# EAGLE design USBC TEST (EAGLE 8.0.0)
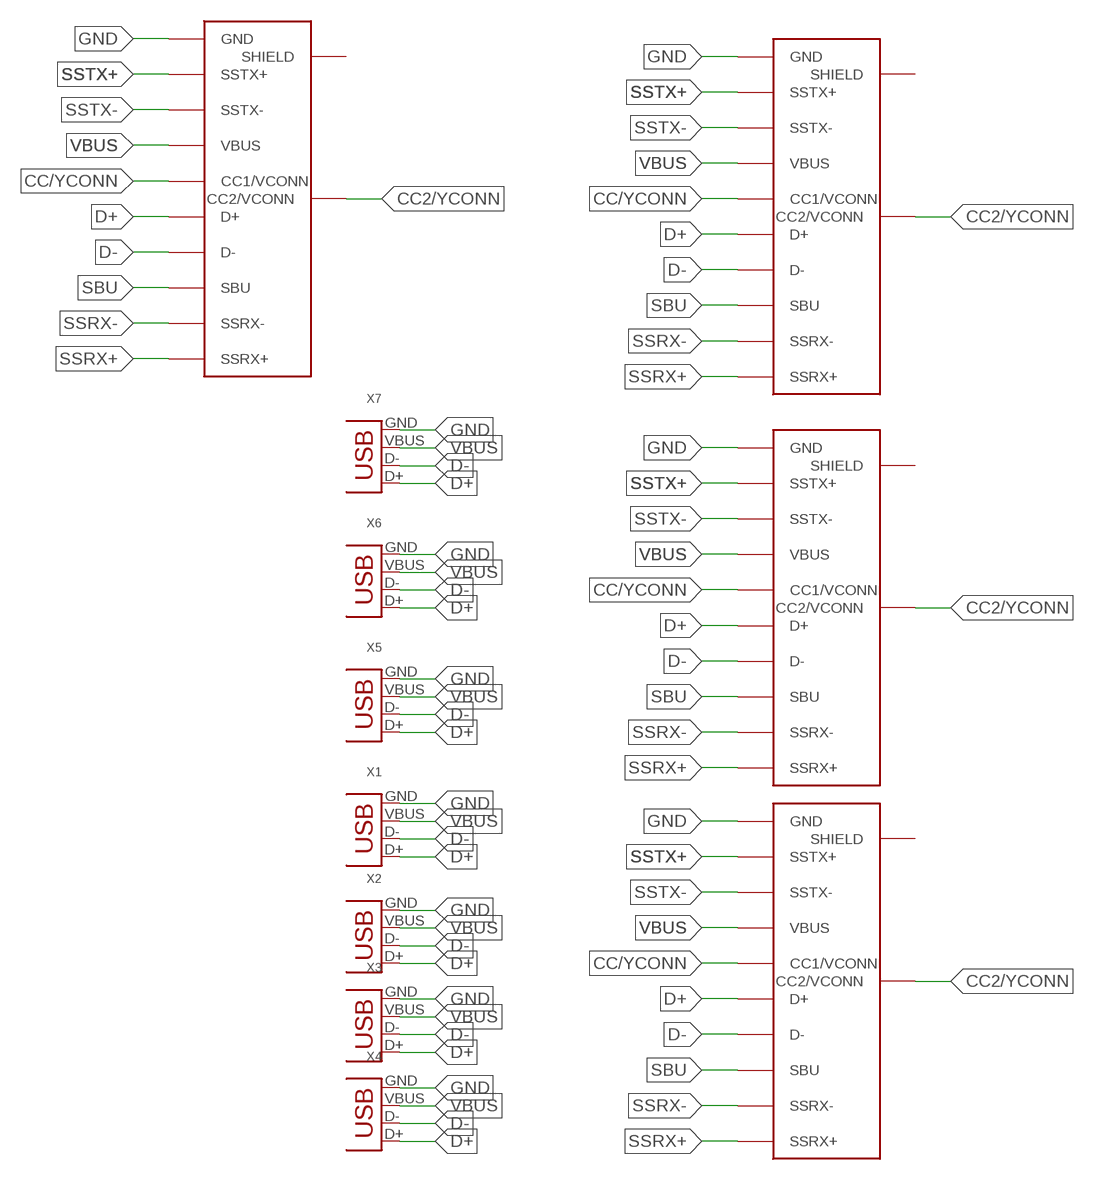
[diagram p0: schematic, sheet 1]

## Parts
U$1  USB-TYPE-C  [USB-TYPE-C-SMT]
U$2  USB-TYPE-C  [USB-TYPE-C-SMT]
U$3  USB-TYPE-C  [USB-TYPE-C-SMT]
U$4  USB-TYPE-C  [USB-TYPE-C-SMT]
X1  USB-A-H  [USB-A-H]
X2  USB-A-H  [USB-A-H]
X3  USB-A-H  [USB-A-H]
X4  USB-A-H  [USB-A-H]
X5  USB-A-H  [USB-A-H]
X6  USB-A-H  [USB-A-H]
X7  USB-A-H  [USB-A-H]

## Nets
CC2/YCONN: U$1.B5(CC2/VCONN) U$2.B5(CC2/VCONN) U$3.B5(CC2/VCONN) U$4.B5(CC2/VCONN)
CC/YCONN: U$1.5(CC1/VCONN) U$2.5(CC1/VCONN) U$3.5(CC1/VCONN) U$4.5(CC1/VCONN)
D+: U$1.6(D+) U$1.B6(D+) U$2.6(D+) U$2.B6(D+) U$3.6(D+) U$3.B6(D+) U$4.6(D+) U$4.B6(D+) X1.D+ X2.D+ X3.D+ X4.D+ X5.D+ X6.D+ X7.D+
D-: U$1.7(D-) U$1.B7(D-) U$2.7(D-) U$2.B7(D-) U$3.7(D-) U$3.B7(D-) U$4.7(D-) U$4.B7(D-) X1.D- X2.D- X3.D- X4.D- X5.D- X6.D- X7.D-
GND: U$1.1(GND) U$1.12(GND) U$1.B1(GND) U$1.B12(GND) U$2.1(GND) U$2.12(GND) U$2.B1(GND) U$2.B12(GND) U$3.1(GND) U$3.12(GND) U$3.B1(GND) U$3.B12(GND) U$4.1(GND) U$4.12(GND) U$4.B1(GND) U$4.B12(GND) X1.GND X2.GND X3.GND X4.GND X5.GND X6.GND X7.GND
SBU: U$1.8(SBU) U$1.B8(SBU) U$2.8(SBU) U$2.B8(SBU) U$3.8(SBU) U$3.B8(SBU) U$4.8(SBU) U$4.B8(SBU)
SSRX+: U$1.11(SSRX+) U$1.B11(SSRX+) U$2.11(SSRX+) U$2.B11(SSRX+) U$3.11(SSRX+) U$3.B11(SSRX+) U$4.11(SSRX+) U$4.B11(SSRX+)
SSRX-: U$1.10(SSRX-) U$1.B10(SSRX-) U$2.10(SSRX-) U$2.B10(SSRX-) U$3.10(SSRX-) U$3.B10(SSRX-) U$4.10(SSRX-) U$4.B10(SSRX-)
SSTX+: U$1.2(SSTX+) U$1.B2(SSTX+) U$2.2(SSTX+) U$2.B2(SSTX+) U$3.2(SSTX+) U$3.B2(SSTX+) U$4.2(SSTX+) U$4.B2(SSTX+)
SSTX-: U$1.3(SSTX-) U$1.B3(SSTX-) U$2.3(SSTX-) U$2.B3(SSTX-) U$3.3(SSTX-) U$3.B3(SSTX-) U$4.3(SSTX-) U$4.B3(SSTX-)
VBUS: U$1.4(VBUS) U$1.9(VBUS) U$1.B4(VBUS) U$1.B9(VBUS) U$2.4(VBUS) U$2.9(VBUS) U$2.B4(VBUS) U$2.B9(VBUS) U$3.4(VBUS) U$3.9(VBUS) U$3.B4(VBUS) U$3.B9(VBUS) U$4.4(VBUS) U$4.9(VBUS) U$4.B4(VBUS) U$4.B9(VBUS) X1.VBUS X2.VBUS X3.VBUS X4.VBUS X5.VBUS X6.VBUS X7.VBUS
Unconnected: U$1.P$1(SHIELD) U$1.P$2(SHIELD) U$1.P$3(SHIELD) U$1.P$4(SHIELD) U$1.P$5(SHIELD) U$1.P$6(SHIELD) U$1.P$7(SHIELD) U$1.P$8(SHIELD) U$1.P$9(SHIELD) U$1.P$10(SHIELD) U$1.P$11(SHIELD) U$1.P$12(SHIELD) U$1.P$13(SHIELD) U$1.P$14(SHIELD) U$1.P$15(SHIELD) U$1.P$16(SHIELD) U$1.P$17(SHIELD) U$1.P$18(SHIELD) U$1.P$19(SHIELD) U$1.P$20(SHIELD) U$1.P$21(SHIELD) U$1.P$22(SHIELD) U$1.P$23(SHIELD) U$1.P$24(SHIELD) U$1.P$25(SHIELD) U$1.P$26(SHIELD) U$1.P$27(SHIELD) U$1.P$28(SHIELD) U$2.P$1(SHIELD) U$2.P$2(SHIELD) U$2.P$3(SHIELD) U$2.P$4(SHIELD) U$2.P$5(SHIELD) U$2.P$6(SHIELD) U$2.P$7(SHIELD) U$2.P$8(SHIELD) U$2.P$9(SHIELD) U$2.P$10(SHIELD) U$2.P$11(SHIELD) U$2.P$12(SHIELD) U$2.P$13(SHIELD) U$2.P$14(SHIELD) U$2.P$15(SHIELD) U$2.P$16(SHIELD) U$2.P$17(SHIELD) U$2.P$18(SHIELD) U$2.P$19(SHIELD) U$2.P$20(SHIELD) U$2.P$21(SHIELD) U$2.P$22(SHIELD) U$2.P$23(SHIELD) U$2.P$24(SHIELD) U$2.P$25(SHIELD) U$2.P$26(SHIELD) U$2.P$27(SHIELD) U$2.P$28(SHIELD) U$3.P$1(SHIELD) U$3.P$2(SHIELD) U$3.P$3(SHIELD) U$3.P$4(SHIELD) U$3.P$5(SHIELD) U$3.P$6(SHIELD) U$3.P$7(SHIELD) U$3.P$8(SHIELD) U$3.P$9(SHIELD) U$3.P$10(SHIELD) U$3.P$11(SHIELD) U$3.P$12(SHIELD) U$3.P$13(SHIELD) U$3.P$14(SHIELD) U$3.P$15(SHIELD) U$3.P$16(SHIELD) U$3.P$17(SHIELD) U$3.P$18(SHIELD) U$3.P$19(SHIELD) U$3.P$20(SHIELD) U$3.P$21(SHIELD) U$3.P$22(SHIELD) U$3.P$23(SHIELD) U$3.P$24(SHIELD) U$3.P$25(SHIELD) U$3.P$26(SHIELD) U$3.P$27(SHIELD) U$3.P$28(SHIELD) U$4.P$1(SHIELD) U$4.P$2(SHIELD) U$4.P$3(SHIELD) U$4.P$4(SHIELD) U$4.P$5(SHIELD) U$4.P$6(SHIELD) U$4.P$7(SHIELD) U$4.P$8(SHIELD) U$4.P$9(SHIELD) U$4.P$10(SHIELD) U$4.P$11(SHIELD) U$4.P$12(SHIELD) U$4.P$13(SHIELD) U$4.P$14(SHIELD) U$4.P$15(SHIELD) U$4.P$16(SHIELD) U$4.P$17(SHIELD) U$4.P$18(SHIELD) U$4.P$19(SHIELD) U$4.P$20(SHIELD) U$4.P$21(SHIELD) U$4.P$22(SHIELD) U$4.P$23(SHIELD) U$4.P$24(SHIELD) U$4.P$25(SHIELD) U$4.P$26(SHIELD) U$4.P$27(SHIELD) U$4.P$28(SHIELD)

## Library data of the parts
U$1-U$4 = lio:USB-TYPE-C; MPN: 12401562E4#2A; OC_NEWARK: 52Y0685
X1-X7 = con-usb-3:USB: USB Connectors; MPN: 48394-0003; OC_NEWARK: 29X4572

## Net classes
0 default: width 0.305 mm, drill 0.508 mm, clearance 0.254 mm

## Board
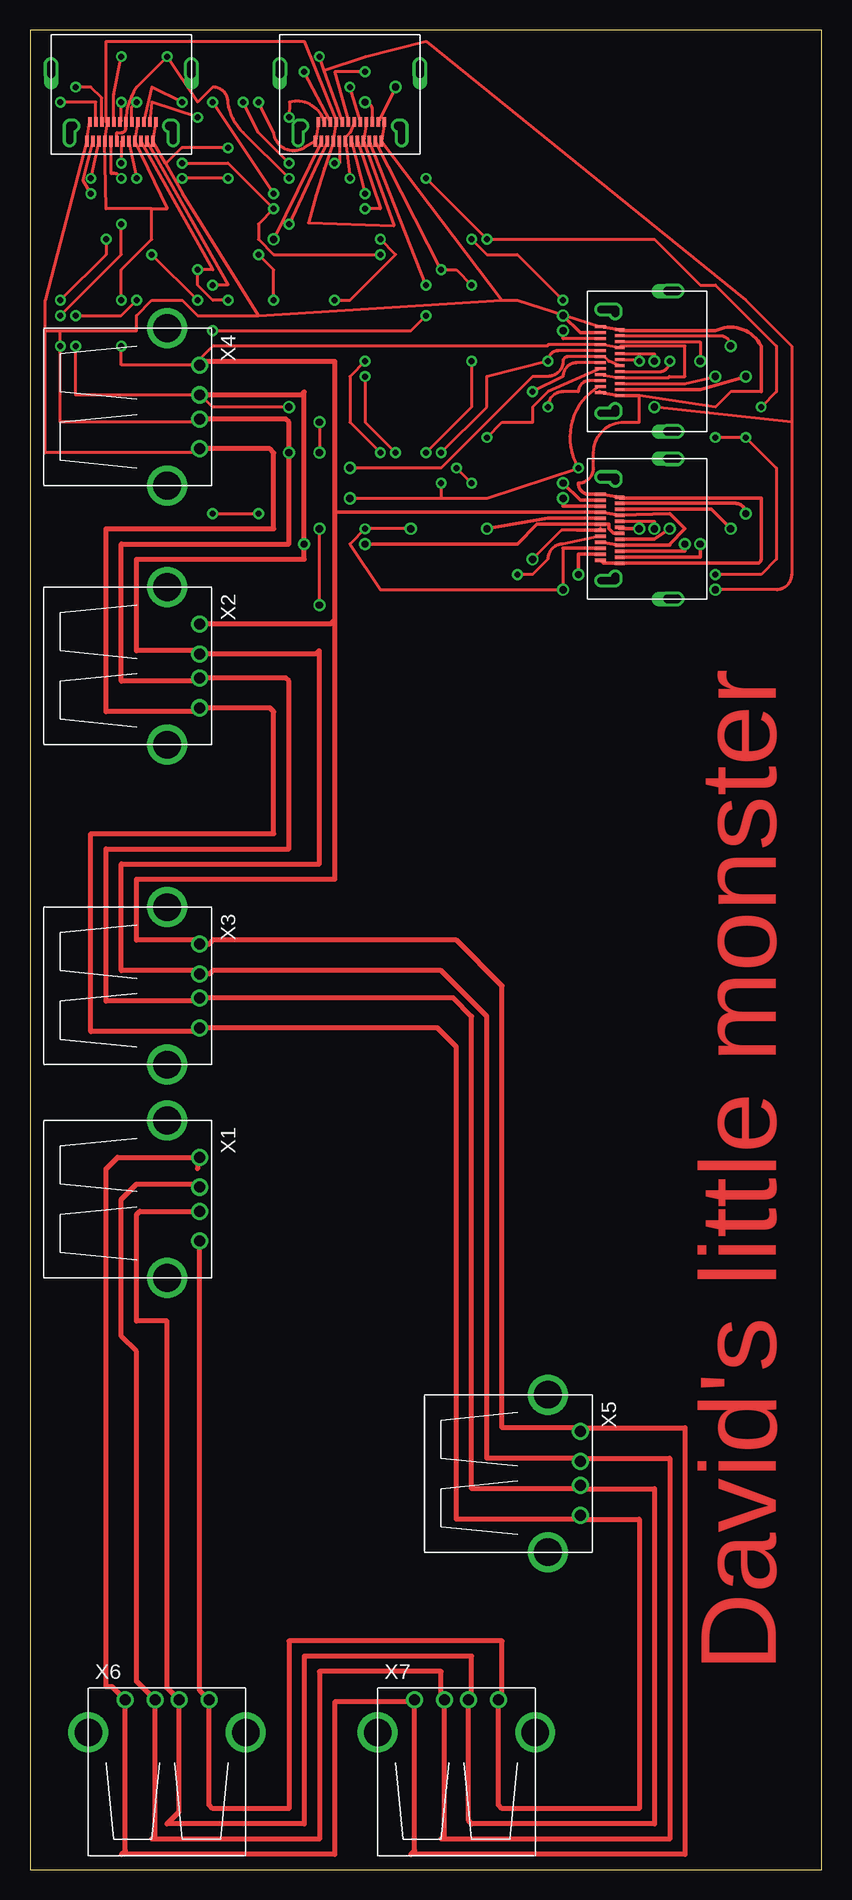
[diagram p1: board, top side]
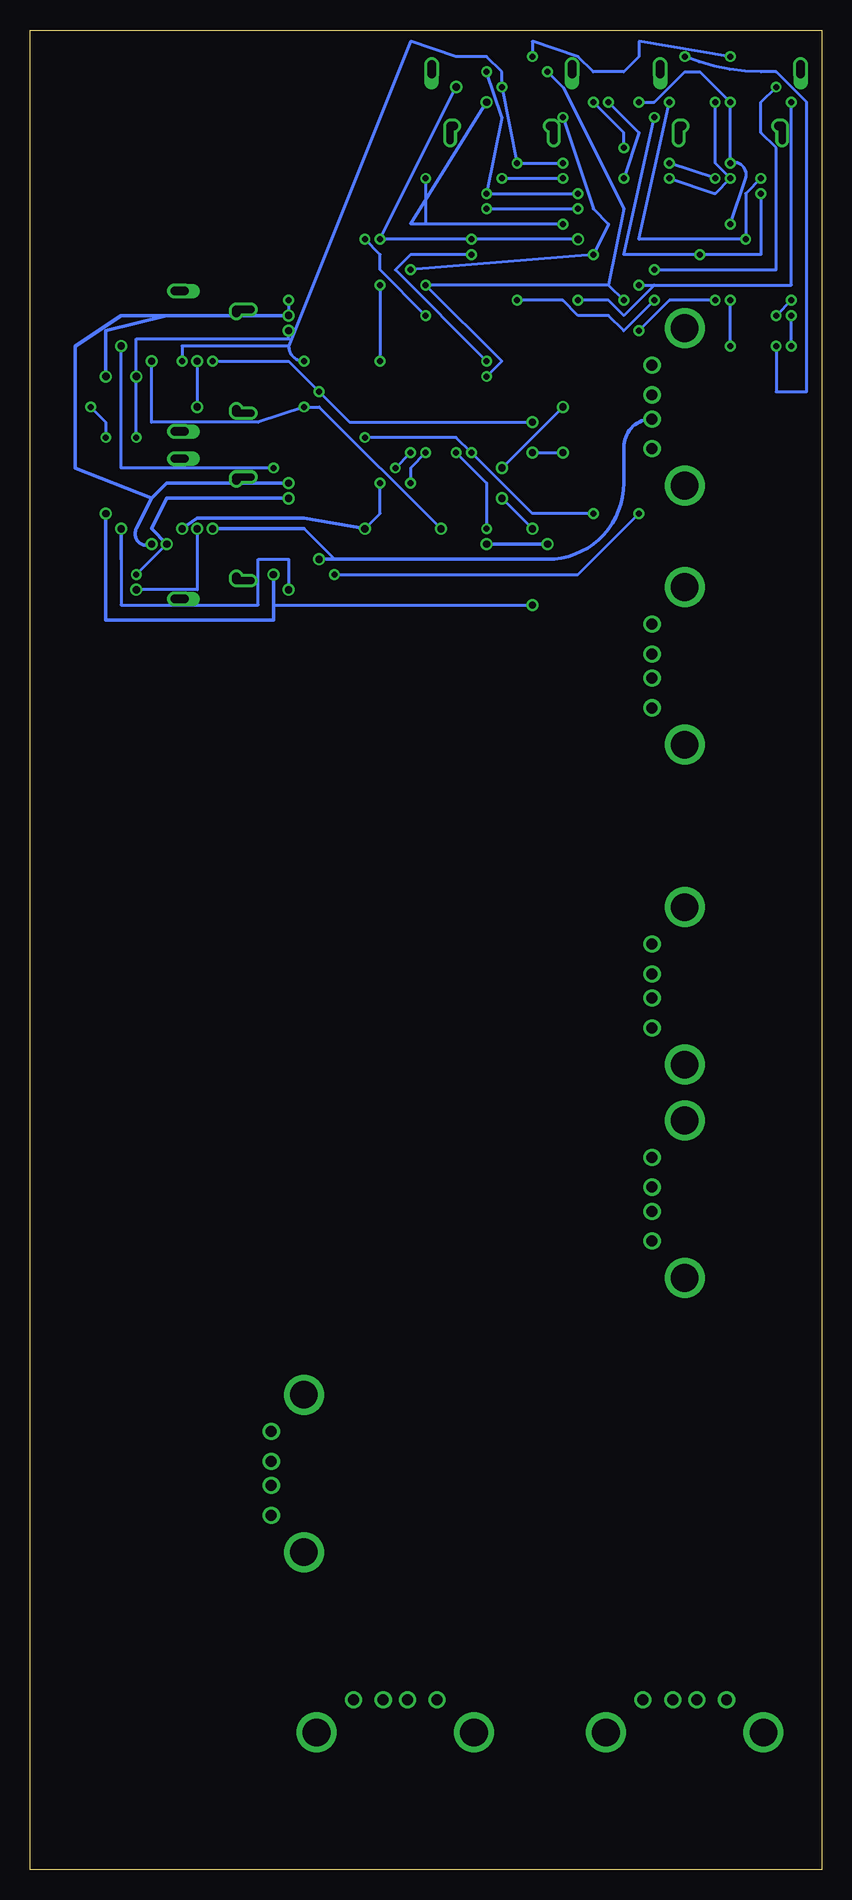
[diagram p2: board, bottom side, seen from below]

Size 66.02 x 153.34 mm. Coordinates in mm from the lower left corner, seen from the top.
Outline: 0,0 66.02,0 66.02,153.34 0,153.34 0,0
Copper layers (1*16): Top 0.035mm / dielectric 1.5mm / Bottom 0.035mm
Design rules "default": minimum track width 10mil, minimum drill 24mil, track to track 8mil, track to pad 8mil, pad to pad 8mil, via to via 8mil, smd to smd 8mil, copper to edge 40mil, drill to drill 8mil, minimum pad ring 10mil, minimum via ring 8mil, stop-mask expansion 4mil, vias tented up to drill 0mil, thermal gap 10mil

### Footprints (pad centres in the part's own frame; a part is rotated, then mirrored left to right if it is on the bottom)
USB-TYPE-C-SMT = smd 0.27 x 0.9: 1 -2.625,0.7; 2 -2.125,0.7; 3 -1.625,0.7; 4 -1.125,0.7; 5 -0.625,0.7; 6 -0.125,0.7; 7 0.375,0.7; 8 0.875,0.7; 9 1.375,0.7; 10 1.875,0.7; 11 2.375,0.7; 12 2.875,0.7 | smd 0.27 x 0.8: B1 2.625,-0.9; B2 2.125,-0.9; B3 1.625,-0.9; B4 1.125,-0.9; B5 0.625,-0.9; B6 0.125,-0.9; B7 -0.375,-0.9; B8 -0.875,-0.9; B9 -1.375,-0.9; B10 -1.875,-0.9; B11 -2.375,-0.9; B12 -2.875,-0.9 | drill 0.6: P$1 -4.32,0.25; P$2 4.32,0.65; P$3 -4.32,0.65; P$4 -4.32,0.45; P$7 -4.32,-0.35; P$8 -4.32,0.05; P$9 -4.32,-0.15; P$10 4.32,0.45; P$11 4.32,0.25; P$12 4.32,0.05; P$13 4.32,-0.15; P$14 4.32,-0.35 | drill 0.7 offset: P$5 5.85,-5.4; P$23 -5.85,-5.4 | drill 0.7: P$6 -5.85,-5.3; P$15 4.27,-0.55; P$16 -4.02,-0.55; P$17 -4.27,-0.55; P$18 4.02,-0.55; P$19 -5.85,-5.7; P$20 -5.85,-5.5; P$21 -5.85,-5.1; P$22 -5.85,-4.9; P$24 5.85,-5.7; P$25 5.85,-5.5; P$26 5.85,-5.3; P$27 5.85,-5.1; P$28 5.85,-4.9
USB-A-H = drill 0.914: D+ 2.718,-1.003; D- 2.718,1.003; GND 2.718,-3.493; VBUS 2.718,3.493 | drill 2.311: P$5 0,-6.566; P$6 0,6.566

### Placement (x,y rotation side)
U$1  48.26,125.73 90 top
U$2  48.26,111.76 90 top
U$3  26.67,144.78 180 top
U$4  7.62,144.78 180 top
X1  11.43,55.88 0 top
X2  11.43,100.33 0 top
X3  11.43,73.66 0 top
X4  11.43,121.92 0 top
X5  43.18,33.02 0 top
X6  11.43,11.43 90 top
X7  35.56,11.43 90 top

### Tracks (layer width: path | path; a pad name or v marks a point on that pad's centre or on a via)
CC2/YCONN  (via drill 0.5, 0.6)
  Top 0.254: U$1.B5 52.07,126.36 v52.07,125.73 | U$2.B5 52.07,112.39 v52.07,111.76 | v57.15,106.68 62.23,106.68 arc90 63.5,107.95 63.5,120.65 | 63.5,120.65 v52.07,121.92 | 24.53,150 U$3.B5 25.46,147.34 | 24.53,150 v24.13,151.13 | U$4.B5 7,147.97 v7.62,151.13 | 24.53,150 27.94,151.13 33.02,152.4 59.69,130.81 63.5,127 63.5,120.65
  Bottom 0.254: v52.07,111.76 52.07,106.68 v57.15,106.68 | v52.07,125.73 v52.07,121.92 | v7.62,151.13 15.24,152.4 15.24,151.13 16.51,149.86 19.05,149.86 20.32,151.13 24.13,152.4 v24.13,151.13
CC/YCONN  (via drill 0.5)
  Top 0.254: U$4.5 v8.89,140.97 | U$3.5 29.21,138.43 v27.94,138.43 | v12.7,142.24 16.51,142.24 v20.32,138.43 19.05,137.16 19.05,135.89 20.32,134.62 v29.21,134.62 | U$1.5 43.18,123.19 41.91,121.92 41.91,120.65 39.37,120.65 v38.1,119.38 | U$2.5 44.45,110.49 arc90 43.18,109.22 41.91,107.95 v40.64,107.95 | v15.24,113.03 v19.05,113.03 | v29.21,118.11 26.67,120.65 26.67,124.46 v27.94,125.73
  Bottom 0.254: v8.89,140.97 v12.7,142.24 | v27.94,138.43 v20.32,138.43 | v38.1,119.38 30.48,119.38 v29.21,118.11 24.13,113.03 v19.05,113.03 | v15.24,113.03 20.32,107.95 v40.64,107.95 | v27.94,125.73 35.56,133.35 34.29,134.62 v29.21,134.62
D+  (via drill 0.5, 0.6)
  Top 0.254: U$1.6 45.59,125.61 arc90 44.45,124.46 v41.91,123.19 | U$1.B6 50.67,125.86 v50.8,125.73 | 45.59,111.64 44.33,111.64 v41.91,109.22 | v24.13,120.65 v24.13,118.11 | U$3.6 v27.94,139.7 | v27.94,149.86 25.4,149.86 U$3.B6 | U$4.6 arc90 7.62,143.95 v7.62,142.24 | U$4.B6 arc90 7.62,145.81 v7.62,147.32 | v20.32,139.7 v15.24,147.32 | X4.D+ 13.88,120.65 2.54,120.65 v2.54,127 2.54,128.27 | v2.54,129.54 7.62,134.62 v7.62,137.16
  Top 0.305: U$2.B6 49.16,111.76 v50.8,111.76 | 47.56,111.76 U$2.6 45.59,111.64
  Top 0.406: 14.15,54.61 X1.D+ 9.16,54.88 8.89,54.61 8.89,45.72 11.43,45.72 11.43,15.15 X6.D+ 12.43,4.81 11.43,3.81 22.86,3.81 22.86,17.78 36.83,17.78 36.83,14.42 X7.D+ 36.56,4.08 36.83,3.81 52.07,3.81 52.07,31.75 46.16,31.75 X5.D+ 45.63,31.75 36.83,31.75 36.83,71.12 35.29,72.66 X3.D+ 13.88,72.39 6.35,72.39 6.35,85.09 21.59,85.09 21.59,99.06 21.32,99.33 X2.D+ 13.88,99.06 7.62,99.06 7.62,110.49 21.59,110.49 v21.59,118.11 21.59,120.65 21.32,120.92 X4.D+
  Bottom 0.254: v50.8,125.73 44.45,125.73 v41.91,123.19 39.37,120.65 v24.13,120.65 | 43.18,111.76 40.64,109.22 | v24.13,118.11 v21.59,118.11 | v27.94,149.86 26.67,146.05 v27.94,139.7 v20.32,139.7 | v15.24,147.32 13.97,147.32 11.43,149.86 10.16,149.86 v7.62,147.32 v7.62,142.24 arc127 6.35,140.97 v7.62,137.16 | v2.54,127 v2.54,129.54
  Bottom 0.305: v41.91,109.22 40.64,109.22 22.86,109.22 arc-90 16.51,115.57 16.51,118.56 arc90 X4.D+ | v50.8,111.76 43.18,111.76
D-  (via drill 0.5, 0.6)
  Top 0.254: U$1.B7 48.26,125.73 47.88,126.11 U$1.7 44.83,126.11 arc90 44.45,125.73 arc-90 43.18,124.46 41.91,124.46 34.29,116.84 v26.67,116.84 | v21.59,121.92 15.24,121.92 13.97,123.19 X4.D- 3.81,122.92 v3.81,127 | U$3.B7 26.67,144.78 26.3,144.41 U$3.7 v26.67,140.97 | U$4.7 7.25,144.78 7.62,144.78 arc90 8,145.16 U$4.B7 arc-34 8.89,148.59 v11.43,151.13 13.97,147.32 15.24,148.59 arc-90 16.51,147.32 arc37 17.78,144.78 v21.59,140.97
  Top 0.305: U$2.B7 48.63,111.39 48.26,111.76 48.26,112.14 U$2.7 42.28,112.14 40.64,110.49 v27.94,110.49
  Top 0.406: X1.D- 14.15,57.15 8.89,57.15 7.62,55.88 7.62,44.45 8.89,43.18 8.89,15.68 X6.D- 10.43,2.81 10.16,2.54 24.13,2.54 24.13,16.51 34.29,16.51 34.29,14.42 X7.D- 34.56,2.81 34.29,2.54 53.34,2.54 53.34,34.29 46.16,34.29 X5.D- 45.63,34.29 38.1,34.29 38.1,71.12 34.29,74.93 15.24,74.93 14.97,74.66 X3.D- 13.88,74.93 7.62,74.93 7.62,83.82 24.13,83.82 24.13,101.6 23.86,101.33 X2.D- 13.88,101.6 8.89,101.6 8.89,109.22 22.86,109.22 v22.86,110.49 22.86,123.19 22.59,122.92 X4.D-
  Bottom 0.254: v26.67,116.84 v21.59,121.92 | v26.67,140.97 v21.59,140.97 | v3.81,127 3.81,123.19 1.27,123.19 1.27,147.32 3.81,149.86 5.08,149.86 arc23 v11.43,151.13
  Bottom 0.305: v22.86,110.49 v27.94,110.49
GND  (via drill 0.5)
  Top 0.254: 45.72,115.57 arc90 46.99,116.84 46.99,118.11 arc-90 49.53,120.65 50.8,120.65 50.8,122.86 57.15,121.92 58.42,123.19 60.96,123.19 | U$1.12 40.64,130.81 39.37,130.81 | U$3.B12 U$3.1 39.37,130.81 | U$3.B1 U$3.12 22.86,143.51 arc-116 20.32,144.78 v19.05,147.32 | 19.05,129.54 39.37,130.81 | U$4.B1 U$4.12 1.27,130.81 1.27,128.27 | U$4.B12 U$4.1 11.32,142.18 | 11.32,142.18 12.72,139.71 19.05,129.54 | 1.27,128.27 8.89,128.27 8.89,129.54 10.16,130.81 12.7,130.81 13.97,129.54 19.05,129.54 | v16.51,143.51 12.65,143.51 11.32,142.18 | X4.GND 13.83,118.11 1.27,118.11 1.27,128.27
  Top 0.305: U$2.1 47.81,108.89 U$2.B12 60.62,108.89 arc90 60.96,109.22 60.96,114.3 49.24,114.3 | U$2.B1 arc90 49.24,114.3 | U$2.B1 U$2.12 46.66,114.64 arc-90 45.72,115.57 | 47.48,123.19 arc-90 U$1.1 U$1.B12 50.8,122.86 | 60.96,123.19 60.96,127 arc90 57.15,128.27 49.24,128.27 arc-90 U$1.B1 U$1.12 | X4.GND arc-90 13.83,118.11 | 49.24,114.3 arc-90 U$2.B1
  Top 0.406: 14.15,52.07 X1.GND 14.15,14.92 X6.GND 14.92,5.4 15.24,5.08 21.59,5.08 21.59,19.05 39.37,19.05 39.37,14.47 X7.GND 39.05,5.4 39.37,5.08 50.8,5.08 50.8,29.21 46.22,29.21 X5.GND 45.58,29.21 35.56,29.21 35.56,68.58 33.97,70.17 X3.GND 13.83,69.85 5.08,69.85 5.08,86.36 20.32,86.36 20.32,96.52 20,96.84 X2.GND 13.83,96.52 6.35,96.52 6.35,111.76 20.32,111.76 20.32,118.11 20,118.43 X4.GND
  Bottom 0.254: v16.51,143.51 16.51,144.78 v19.05,147.32
SBU  (via drill 0.5, 0.6)
  Top 0.254: U$3.8 25.8,142.24 v25.4,142.24 | U$3.B8 v26.67,148.59 | U$4.8 6.75,141.37 arc-90 v7.62,140.97 | U$4.B8 8.49,146.93 v8.89,147.32 | v21.59,142.24 19.05,144.78 v17.78,147.32 | v16.51,140.97 v12.7,140.97 | v34.29,118.11 38.1,121.92 38.1,124.46 v43.18,125.73 arc-90 44.05,126.61 U$1.8 | v36.83,115.57 v35.56,116.84 | U$1.B8 52.47,124.86 arc90 v53.34,125.73
  Top 0.305: U$2.B8 52.07,110.89 v53.34,111.76 | U$2.8 43.18,112.64 v38.1,111.76
  Bottom 0.254: v8.89,147.32 8.89,142.24 v7.62,140.97 8.89,139.7 v12.7,140.97 | v21.59,142.24 v25.4,142.24 v26.67,148.59 26.67,149.86 27.94,151.13 30.48,151.13 34.29,152.4 44.45,127 | v17.78,147.32 15.24,144.78 v16.51,140.97 | v35.56,116.84 v34.29,118.11 | v36.83,115.57 36.83,113.03 v38.1,111.76 | 44.45,127 arc-90 v43.18,125.73 | 44.45,127 53.34,127 v53.34,125.73
  Bottom 0.305: v53.34,111.76 52.07,112.64 43.18,112.64 v38.1,111.76
SSRX+  (via drill 0.5, 0.6)
  Top 0.254: U$3.11 v20.32,135.89 | v30.48,148.59 U$3.B11 | v5.08,139.7 4.42,140.82 U$4.11 | v13.97,146.05 10.16,147.32 U$4.B11 | v29.21,135.89 30.48,134.62 26.67,130.81 v25.4,130.81 | v10.16,134.62 v13.97,130.81 | v44.45,130.81 40.64,134.62 38.1,134.62 v36.83,135.89
  Top 0.305: U$2.B11 55.88,109.39 v55.88,110.49 | U$2.11 45.88,114.14 v44.45,115.57 | U$1.B11 55.88,123.36 v59.69,124.46 | U$1.11 45.88,128.11 v44.45,129.54
  Bottom 0.254: v20.32,135.89 v29.21,135.89 v36.83,135.89 v30.48,148.59 | v5.08,139.7 5.08,134.62 v10.16,134.62 16.51,134.62 v13.97,146.05 | v25.4,130.81 21.59,130.81 20.32,129.54 17.78,129.54 16.51,128.27 v13.97,130.81 | v44.45,130.81 v44.45,129.54
  Bottom 0.305: 55.88,114.3 54.61,115.57 v44.45,115.57 | v59.69,124.46 59.69,128.27 54.61,129.54 | 54.61,129.54 v44.45,129.54 | 54.61,129.54 58.42,129.54 62.23,127 62.23,116.84 55.88,114.3 | 55.88,114.3 57.15,111.76 arc-143 v55.88,110.49
SSRX-  (via drill 0.5, 0.6)
  Top 0.254: U$1.B10 54.61,123.86 v57.15,124.46 | U$1.10 44.45,127.61 v44.45,128.27 | U$3.B10 28.55,146.72 arc90 v27.94,147.32 | U$4.10 v5.08,140.97 | v12.7,147.32 10.16,148.59 U$4.B10 | U$3.10 v21.59,137.16 | v33.02,140.97 v38.1,135.89 52.07,135.89 55.88,132.08 57.15,132.08 62.23,127 62.23,123.19 v60.96,121.92 | v33.02,129.54 31.75,128.27 v15.24,128.27 | v8.89,130.81 7.62,129.54 v3.81,129.54 | v2.54,130.81 6.35,134.62 v6.35,135.89 | v57.15,119.38 v59.69,119.38 62.23,116.84 62.23,109.22 60.96,107.95 v57.15,107.95
  Top 0.305: U$2.B10 54.61,109.89 v54.61,110.49 | U$2.10 44.45,113.64 v44.45,114.3
  Bottom 0.254: v44.45,128.27 44.45,127.61 57.15,127.61 v57.15,124.46 v57.15,119.38 | v27.94,147.32 34.29,137.16 33.02,137.16 | v21.59,137.16 33.02,137.16 | v5.08,140.97 6.35,139.7 v6.35,135.89 15.24,135.89 v12.7,147.32 | v33.02,140.97 33.02,137.16 | v38.1,135.89 36.83,134.62 36.83,133.35 v33.02,129.54 | v15.24,128.27 12.7,130.81 v8.89,130.81 | v2.54,130.81 v3.81,129.54 | v59.69,119.38 59.69,120.65 v60.96,121.92 | v57.15,107.95 v54.61,110.49
  Bottom 0.305: v44.45,114.3 54.61,114.3 55.88,111.76 v54.61,110.49
SSTX+  (via drill 0.5, 0.6)
  Top 0.254: U$1.2 47.41,123.61 arc90 v45.72,116.84 38.1,114.3 34.29,114.3 | U$1.B2 57.56,127.86 arc-90 v58.42,127 | v26.67,114.3 34.29,114.3 | v24.13,105.41 v24.13,111.76 | U$3.2 v34.29,133.35 35.56,133.35 v36.83,132.08 | U$4.2 16.51,132.08 v15.24,132.08 | U$4.B2 5.5,147.32 v2.54,147.32 | U$3.B2 arc90 21.64,147.32 v21.59,146.05 | v19.05,134.62 20.32,133.35 v20.32,130.81 | v34.29,115.57 34.29,114.3 | v33.02,118.11 36.83,121.92 v36.83,125.73
  Top 0.305: U$2.B2 58.84,113.89 arc-90 v59.69,113.03 | U$2.2 45.72,109.64 v45.72,107.95
  Bottom 0.254: v45.72,116.84 58.42,116.84 v58.42,127 | v24.13,111.76 v26.67,114.3 | 45.72,105.41 v24.13,105.41 | v21.59,146.05 19.05,138.43 17.78,137.16 v19.05,134.62 v34.29,133.35 | v15.24,132.08 13.97,132.08 | 13.97,132.08 2.54,132.08 v2.54,147.32 | v20.32,130.81 17.78,130.81 16.51,129.54 13.97,132.08 | v34.29,115.57 34.29,116.84 v33.02,118.11 | v36.83,132.08 v36.83,125.73
  Bottom 0.305: v59.69,113.03 59.69,104.14 45.72,104.14 45.72,105.41 v45.72,107.95
SSTX-  (via drill 0.5, 0.6)
  Top 0.254: 44.45,110.14 v44.45,106.68 29.21,106.68 26.67,110.49 v27.94,111.76 v31.75,111.76 | U$1.3 46.63,124.11 arc90 45.72,123.19 44.45,123.19 arc90 v43.18,121.92 | U$1.B3 55.88,127.36 v55.88,125.73 | U$3.B3 v22.86,149.86 | v33.02,132.08 U$3.3 | U$4.3 15.24,133.35 v13.97,133.35 13.97,132.08 15.24,130.81 v16.51,130.81 | U$4.B3 6,147.68 5.08,148.59 v3.81,148.59 | v30.48,118.11 27.94,120.65 v27.94,124.46
  Top 0.305: v58.42,111.76 56.8,113.39 U$2.B3 | U$2.3 44.45,110.14
  Bottom 0.254: v55.88,125.73 55.88,120.65 46.99,120.65 v43.18,121.92 41.91,121.92 v31.75,111.76 | 58.42,109.22 58.42,105.41 46.99,105.41 46.99,109.22 44.45,109.22 v44.45,106.68 | v22.86,149.86 21.59,148.59 16.51,138.43 17.78,132.08 | 17.78,132.08 v33.02,132.08 26.67,125.73 v27.94,124.46 | v13.97,133.35 3.81,133.35 3.81,143.51 5.08,144.78 5.08,147.32 v3.81,148.59 | 17.78,132.08 v16.51,130.81 | v27.94,111.76 27.94,115.57 v30.48,118.11
  Bottom 0.305: v58.42,111.76 58.42,109.22
VBUS  (via drill 0.5)
  Top 0.254: U$1.4 U$1.B9 53.23,124.36 arc-90 53.34,124.46 54.61,124.46 54.61,127 49.3,127 arc90 U$1.B4 U$1.9 43.18,127.11 43.18,127 15.24,127 13.97,125.73 X4.VBUS 7.62,125.41 v7.62,127 | U$3.B9 U$3.4 30.34,137.01 23.22,137.27 arc-4 U$3.9 U$3.B4 22.86,152.4 6.35,152.4 6.35,145.68 U$4.B4 U$4.9 6.35,138.43 10.16,138.43 | U$4.B9 U$4.4 11.43,138.43 10.16,138.43 | v7.62,130.81 7.62,133.35 10.16,135.89 10.16,138.43
  Top 0.305: U$2.4 U$2.B9 53.34,110.39 53.34,110.49 54.61,111.76 53.34,113.03 U$2.B4 U$2.9 25.4,113.14 25.4,121.92
  Top 0.406: 7.94,13.97 X6.VBUS | X6.VBUS 7.94,1.59 7.62,1.27 25.4,1.27 25.4,13.97 31.89,13.97 X7.VBUS 32.07,1.59 31.75,1.27 54.61,1.27 54.61,36.83 46.22,36.83 X5.VBUS 45.58,36.83 39.37,36.83 39.37,73.66 35.56,77.47 15.24,77.47 14.92,77.15 X3.VBUS 13.83,77.47 8.89,77.47 8.89,82.55 25.4,82.55 25.4,104.14 | X6.VBUS 6.84,15.24 6.35,15.24 6.35,58.42 7.3,59.37 X1.VBUS 13.97,59.2 13.97,58.42 | 25.4,104.14 25.08,103.82 X2.VBUS | X4.VBUS 14.46,125.73 25.4,125.73 25.4,121.92 25.4,104.14
  Bottom 0.254: v7.62,127 v7.62,130.81

### Text on the board
Top: David's little monster